# Altium project Arb_Power_Booster.PrjPcb (part 2 of 2)

## Sheet ArbPwrBoost_P8.SchDoc: =ProjectTitle
size B; Date: 05/12/25; Engineer: Hab Collector; Organization: Altium Limited; Address1: 3621 Gin Way; Address2: Snellville, GA 30039; DocumentNumber: IMR-005-SCH; Revision: 4; SheetNumber: 8; SheetTotal: 8
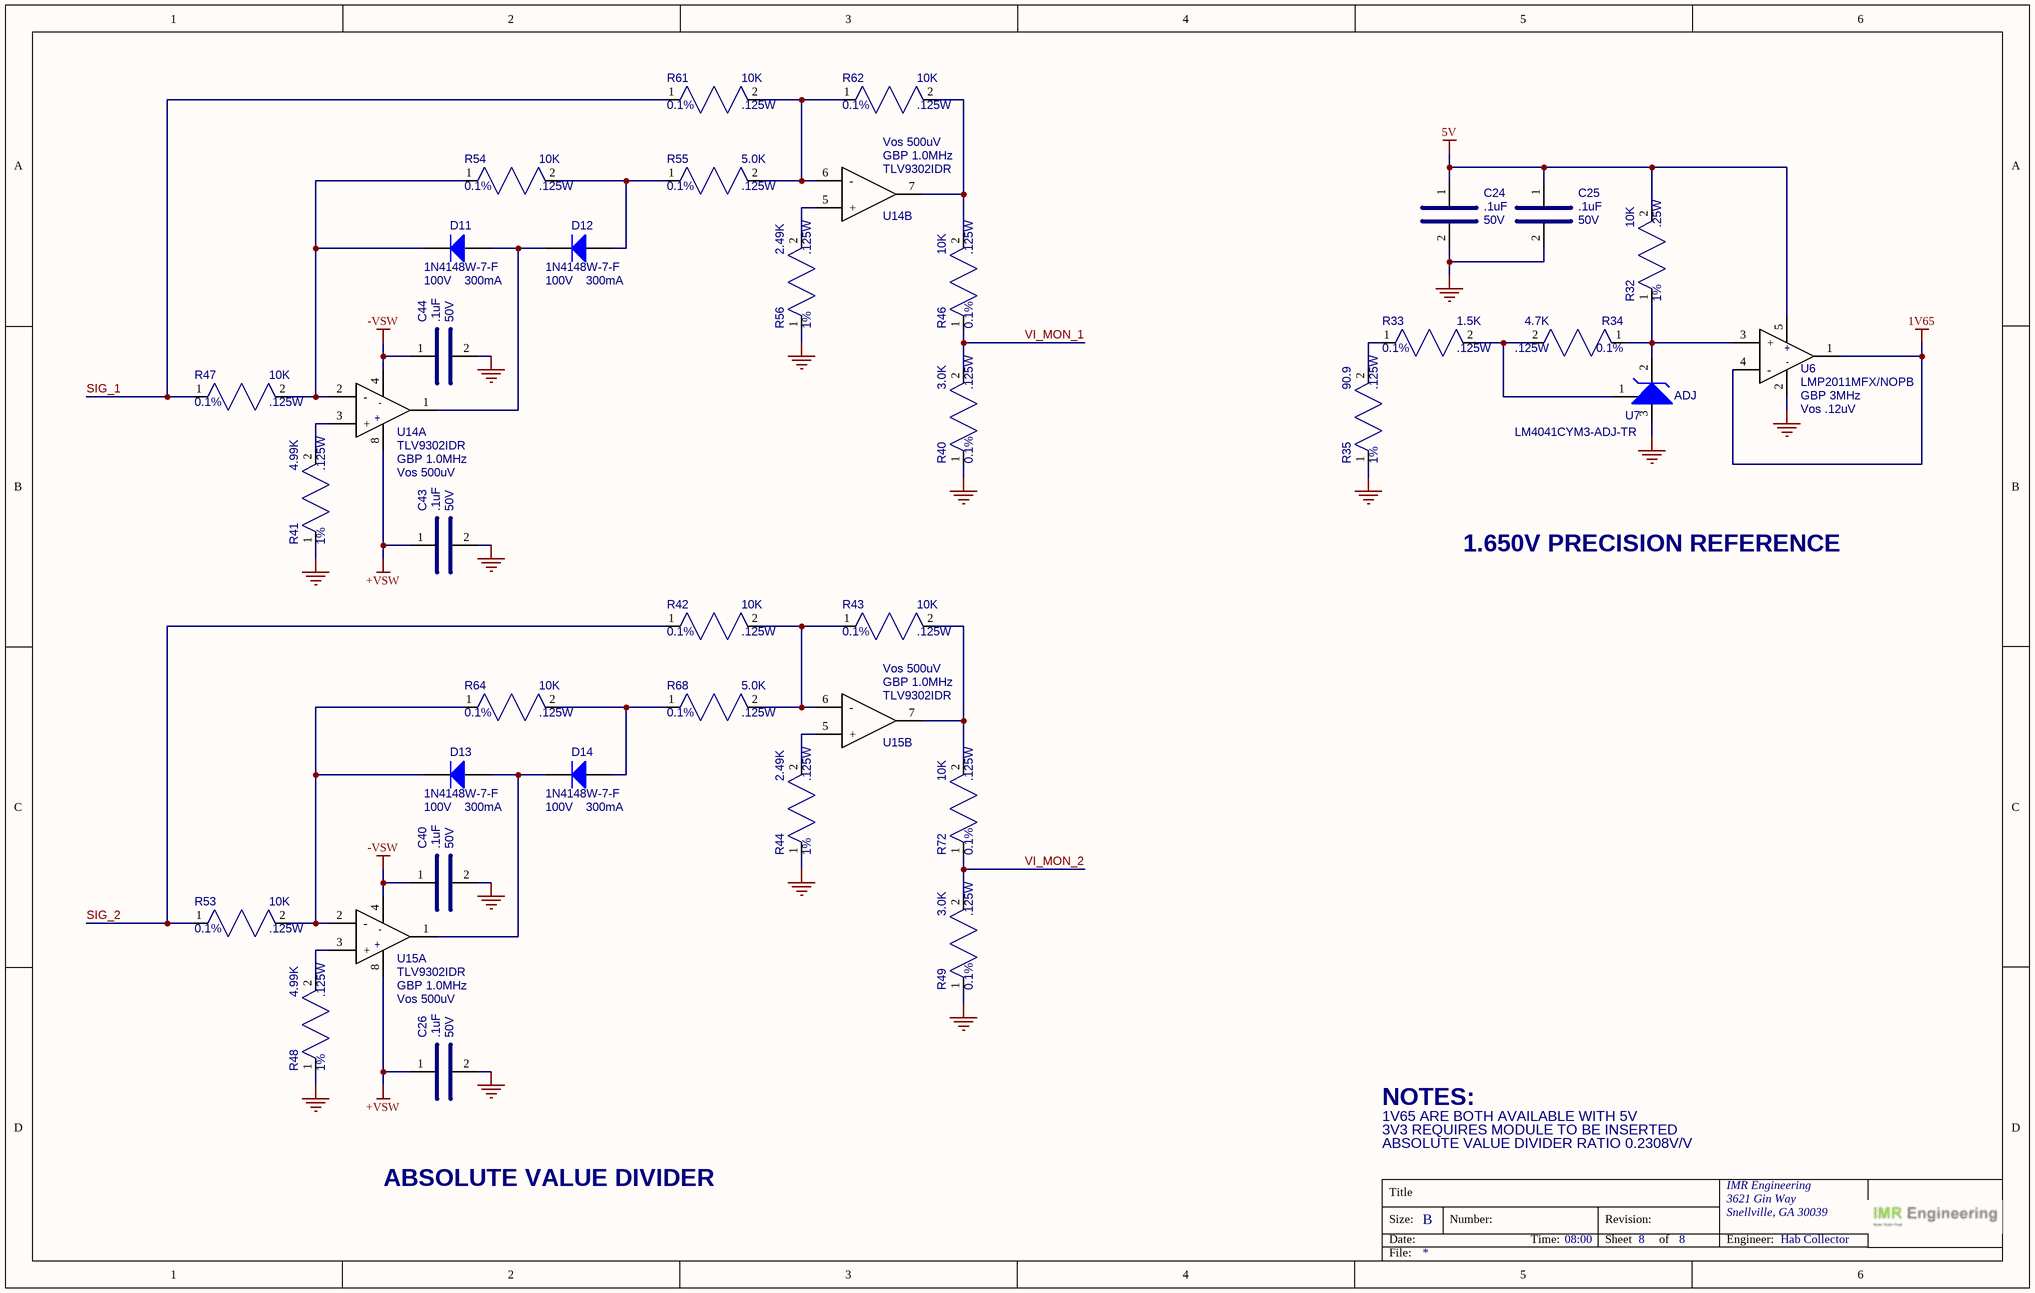
[diagram p7: ArbPwrBoost_P8.SchDoc]

### Parts
C24  value .1uF  Voltage: 50V  [CAP_0805]  (hidden comment: KGM21NR71H104KT)
C25  value .1uF  Voltage: 50V  [CAP_0805]  (hidden comment: KGM21NR71H104KT)
C26  value .1uF  Voltage: 50V  [CAP_0805]  (hidden comment: KGM21NR71H104KT)
C40  value .1uF  Voltage: 50V  [CAP_0805]  (hidden comment: KGM21NR71H104KT)
C43  value .1uF  Voltage: 50V  [CAP_0805]  (hidden comment: KGM21NR71H104KT)
C44  value .1uF  Voltage: 50V  [CAP_0805]  (hidden comment: KGM21NR71H104KT)
D11  value 100V  Current: 300mA  [SOD123]  (hidden comment: 1N4148W-7-F)
D12  value 100V  Current: 300mA  [SOD123]  (hidden comment: 1N4148W-7-F)
D13  value 100V  Current: 300mA  [SOD123]  (hidden comment: 1N4148W-7-F)
D14  value 100V  Current: 300mA  [SOD123]  (hidden comment: 1N4148W-7-F)
R32  value 10K  Power: .25W  Tolerance: 1%  [RES_0805]  (hidden comment: RC0805FR-7W10KL)
R33  value 1.5K  Power: .125W  Tolerance: 0.1%  [RES_0805]  (hidden comment: RT0805BRD071K5L)
R34  value 4.7K  Power: .125W  Tolerance: 0.1%  [RES_0805]  (hidden comment: RT0805BRD074K7L)
R35  value 90.9  Power: .125W  Tolerance: 1%  [RES_0805]  (hidden comment: RC0805FR-0790R9L)
R40  value 3.0K  Power: .125W  Tolerance: 0.1%  [RES_0805]  (hidden comment: RT0805BRD073KL)
R41  value 4.99K  Power: .125W  Tolerance: 1%  [RES_0805]  (hidden comment: RC0805FR-134K99L)
R42  value 10K  Power: .125W  Tolerance: 0.1%  [RES_0805]  (hidden comment: RP0805BRD0710KL)
R43  value 10K  Power: .125W  Tolerance: 0.1%  [RES_0805]  (hidden comment: RP0805BRD0710KL)
R44  value 2.49K  Power: .125W  Tolerance: 1%  [RES_0805]  (hidden comment: RC0805FR-132K49L)
R46  value 10K  Power: .125W  Tolerance: 0.1%  [RES_0805]  (hidden comment: RP0805BRD0710KL)
R47  value 10K  Power: .125W  Tolerance: 0.1%  [RES_0805]  (hidden comment: RP0805BRD0710KL)
R48  value 4.99K  Power: .125W  Tolerance: 1%  [RES_0805]  (hidden comment: RC0805FR-134K99L)
R49  value 3.0K  Power: .125W  Tolerance: 0.1%  [RES_0805]  (hidden comment: RT0805BRD073KL)
R53  value 10K  Power: .125W  Tolerance: 0.1%  [RES_0805]  (hidden comment: RP0805BRD0710KL)
R54  value 10K  Power: .125W  Tolerance: 0.1%  [RES_0805]  (hidden comment: RP0805BRD0710KL)
R55  value 5.0K  Power: .125W  Tolerance: 0.1%  [RES_0805]  (hidden comment: AT0805BRD075KL)
R56  value 2.49K  Power: .125W  Tolerance: 1%  [RES_0805]  (hidden comment: RC0805FR-132K49L)
R61  value 10K  Power: .125W  Tolerance: 0.1%  [RES_0805]  (hidden comment: RP0805BRD0710KL)
R62  value 10K  Power: .125W  Tolerance: 0.1%  [RES_0805]  (hidden comment: RP0805BRD0710KL)
R64  value 10K  Power: .125W  Tolerance: 0.1%  [RES_0805]  (hidden comment: RP0805BRD0710KL)
R68  value 5.0K  Power: .125W  Tolerance: 0.1%  [RES_0805]  (hidden comment: AT0805BRD075KL)
R72  value 10K  Power: .125W  Tolerance: 0.1%  [RES_0805]  (hidden comment: RP0805BRD0710KL)
U6  value GBP 3MHz  Vos: Vos .12uV  [SOT-23-5]  (hidden comment: LMP2011MFX/NOPB)
U7  value ADJ  [SOT-23]  (hidden comment: LM4041CYM3-ADJ-TR)
U14  value GBP 1.0MHz  Vos: Vos 500uV  [SOIC-8_49]  (hidden comment: TLV9302IDR)  (parts A,B of 2)
U15  value GBP 1.0MHz  Vos: Vos 500uV  [SOIC-8_49]  (hidden comment: TLV9302IDR)  (parts A,B of 2)

### Nets
1V65: U6.1 U6.4(-)
5V: C24.1 C25.1 R32.2 U6.5
+VSW: C26.1 C43.1 U14.8 U15.8
-VSW: C40.1 C44.1 U14.4 U15.4
GND: C24.2 C25.2 C26.2 C40.2 C43.2 C44.2 R35.1 R40.1 R41.1 R44.1 R48.1 R49.1 R56.1 U6.2 U7.3(A)
SIG_1: R47.1 R61.1
SIG_2: R42.1 R53.1
VI_MON_1: R40.2 R46.1
VI_MON_2: R49.2 R72.1
NetD11_1: D11.1(A) D12.2(K) U14.1
NetD11_2: D11.2(K) R47.2 R54.1 U14.2(-)
NetD12_1: D12.1(A) R54.2 R55.1
NetD13_1: D13.1(A) D14.2(K) U15.1
NetD13_2: D13.2(K) R53.2 R64.1 U15.2(-)
NetD14_1: D14.1(A) R64.2 R68.1
NetR32_1: R32.1 R34.1 U6.3(+) U7.2(K)
NetR33_1: R33.1 R35.2
NetR33_2: R33.2 R34.2 U7.1(FB)
NetR41_2: R41.2 U14.3(+)
NetR42_2: R42.2 R43.1 R68.2 U15.6(-)
NetR43_2: R43.2 R72.2 U15.7
NetR44_2: R44.2 U15.5(+)
NetR46_2: R46.2 R62.2 U14.7
NetR48_2: R48.2 U15.3(+)
NetR55_2: R55.2 R61.2 R62.1 U14.6(-)
NetR56_2: R56.2 U14.5(+)

### Notes on the sheet
- 1.650V PRECISION REFERENCE
- NOTES:
- 1V65 ARE BOTH AVAILABLE WITH 5V
- 3V3 REQUIRES MODULE TO BE INSERTED
- ABSOLUTE VALUE DIVIDER RATIO 0.2308V/V
- ABSOLUTE VALUE DIVIDER
- Title
- Size:
- Date:
- B
- Number:
- Time:
- Revision:
- Sheet
- of
- IMR Engineering
- Engineer:
- File:

### Library data of the parts
C24-C26 C40 C43 C44 = CAP_SMD_0.1UF_50V_0805: CAP CER 0.1UF 50V X7R 0805; MFG: KYOCERA AVX; Case/Package: 0805; MFG_PN: KGM21NR71H104KT; Supplier 1: DigiKey; Supplier Part Number 1: 478-KGM21NR71H104KTCT-ND; Unit Price: .1
D11-D14 = DIODE_1N4148W-7-F: RELAY REED SPDT 250MA 5V; MFG: Diodes Inc; Case/Package: SOD-123; Supplier 1: DigiKey; Supplier Part Number 1: 1N4148W-FDICT-ND; Unit Price: .16; MFG_PN: 1N4148W-7-F
R32 = RES_SMD_10K_0805_1/4W_1%: RES SMD 10K OHM 1% 1/4W 0805; MFG: Yageo; Case/Package: 0805; MFG_PN: RC0805FR-7W10KL; Supplier 1: DigiKey; Supplier Part Number 1: 13-RC0805FR-7W10KLCT-ND; Unit Price: .10
R33 = RES_SMD_1.5K_0805_1/8W_0.1%: RES SMD 1.5K OHM 0.1% 1/8W 0805; MFG: Yageo; Case/Package: 0805; MFG_PN: RT0805BRD071K5L; Supplier 1: DigiKey; Supplier Part Number 1: YAG1814CT-ND; Unit Price: .16
R34 = RES_SMD_4.7K_0805_1/8W_0.1%: RES SMD 4.7K OHM 0.1% 1/8W 0805; MFG: Yageo; Case/Package: 0805; MFG_PN: RT0805BRD074K7L; Supplier 1: DigiKey; Supplier Part Number 1: YAG1919CT-ND; Unit Price: .16
R35 = RES_SMD_90.9_0805_1/8W_1%: RES SMD 90.9 OHM 1% 1/8W 0805; MFG: Yageo; Case/Package: 0805; MFG_PN: RC0805FR-0790R9L; Supplier 1: DigiKey; Supplier Part Number 1: 311-90.9CRCT-ND; Unit Price: .1
R40 R49 = RES_SMD_3.0K_0805_1/8W_0.1%: RES SMD 3.0K OHM 0.1% 1/8W 0805; MFG: Yageo; Case/Package: 0805; MFG_PN: RT0805BRD073KL; Supplier 1: DigiKey; Supplier Part Number 1: YAG1891CT-ND; Unit Price: 0.16
R41 R48 = RES_SMD_4.99K_0805_1/8W_1%: RES SMD 4.99K OHM 1% 1/8W 0805; MFG: Yageo; Case/Package: 0805; MFG_PN: RC0805FR-134K99L; Supplier 1: DigiKey; Supplier Part Number 1: 13-RC0805FR-134K99LCT-ND; Unit Price: .1
R42 R43 R46 R47 R53 R54 R61 R62 R64 R72 = RES_SMD_10K_0805_1/8W_0.1%: RES SMD 10K OHM 0.1% 1/8W 0805; MFG: Yageo; Case/Package: 0805; MFG_PN: RP0805BRD0710KL; Supplier 1: DigiKey; Supplier Part Number 1: 13-RP0805BRD0710KLCT-ND; Unit Price: .16
R44 R56 = RES_SMD_2.49K_0805_1/8W_1%: RES SMD 2.49K OHM 1% 1/8W 0805; MFG: Yageo; Case/Package: 0805; MFG_PN: RC0805FR-132K49L; Supplier 1: DigiKey; Supplier Part Number 1: 13-RC0805FR-132K49LCT-ND; Unit Price: .1
R55 R68 = RES_SMD_5.0K_0805_1/8W_0.1%: RES SMD 5.0K OHM 0.1% 1/8W 0805; MFG: Yageo; Case/Package: 0805; MFG_PN: AT0805BRD075KL; Supplier 1: DigiKey; Supplier Part Number 1: 13-AT0805BRD075KLCT-ND; Unit Price: .56
U6 = OPAMP_LMP2011MFX/NOPB: IC OPAMP GP 3MHZ .12uV CIRCUIT SOT23-5; MFG: Texas Instruments; Package/Case: SOT-23-5; Supplier 1: DigiKey; MFG_PN: LMP2011MFX/NOPB; Unit Price: 2.33; Supplier Part Number 1: LMP2011MFX/NOPBCT-ND
U7 = IC_LM4041CYM3-ADJ-TR: IC VREF SHUNT ADJ 0.5% SOT23-3; MFG: Microchip; Case/Package: SOT-23; Supplier 1: DigiKey; Supplier Part Number 1: 576-1049-1-ND; Unit Price: .39; MFG_PN: LM4041CYM3-ADJ-TR
U14 U15 = OPAMP_TLV9302IDR: IC OPAMP GP 2 CIRCUIT 8SOIC; MFG: Texas Instruments; Unit Price: .66; Package/Case: SOT-353; Supplier 1: DigiKey; Supplier Part Number 1: 296-53513-1-ND; MFG_PN: TLV9302IDR

## Nets that join several sheets
1V65: ArbPwrBoost_P4 (R73.2), ArbPwrBoost_P7 (R74.2), ArbPwrBoost_P8 (U6.1 U6.4)
3V3: ArbPwrBoost_P2 (D2.2 D7.2), ArbPwrBoost_P3 (C23.1 R30.2 U4.1), ArbPwrBoost_P4 (C27.1 U8.6), ArbPwrBoost_P5 (JP4.2 R50.2 R51.2 R52.2), ArbPwrBoost_P6 (C39.1 R66.2 U11.1), ArbPwrBoost_P7 (C41.1 U13.6)
5V: ArbPwrBoost_P2 (D3.2 JP3.2 R10.2 REL1.1), ArbPwrBoost_P3 (D9.2 REL2.2), ArbPwrBoost_P4 (6 pins), ArbPwrBoost_P5 (C29.1 U9.CN65), ArbPwrBoost_P6 (D15.2 REL4.2), ArbPwrBoost_P7 (6 pins), ArbPwrBoost_P8 (C24.1 C25.1 R32.2 U6.5)
+VSW: ArbPwrBoost_P2 (10 pins), ArbPwrBoost_P3 (5 pins), ArbPwrBoost_P4 (5 pins), ArbPwrBoost_P6 (5 pins), ArbPwrBoost_P7 (5 pins), ArbPwrBoost_P8 (C26.1 C43.1 U14.8 U15.8)
-VSW: ArbPwrBoost_P2 (10 pins), ArbPwrBoost_P3 (C20.2 C21.2 U3.2 U4.10), ArbPwrBoost_P4 (5 pins), ArbPwrBoost_P6 (C36.2 C37.2 U10.2 U11.10), ArbPwrBoost_P7 (5 pins), ArbPwrBoost_P8 (C40.1 C44.1 U14.4 U15.4)
GND: ArbPwrBoost_P2 (31 pins), ArbPwrBoost_P3 (19 pins), ArbPwrBoost_P4 (18 pins), ArbPwrBoost_P5 (10 pins), ArbPwrBoost_P6 (19 pins), ArbPwrBoost_P7 (18 pins), ArbPwrBoost_P8 (15 pins)
+VS_MON: ArbPwrBoost_P2 (D2.1 D4.2 R3.1 R5.2), ArbPwrBoost_P5 (U9.CN53)
-VS_MON: ArbPwrBoost_P2 (D7.1 D8.2 R9.2 U2.4), ArbPwrBoost_P5 (U9.CN54)
~{R_SHDN_1}: ArbPwrBoost_P3 (U4.8), ArbPwrBoost_P5 (U9.CN72)
~{R_SHDN_2}: ArbPwrBoost_P5 (U9.CN46), ArbPwrBoost_P6 (U11.8)
ATTN_1: ArbPwrBoost_P3 (TP4.1 U4.12), ArbPwrBoost_P4 (U12.4)
ATTN_2: ArbPwrBoost_P6 (U11.12), ArbPwrBoost_P7 (U17.4)
EN_50_Z_1: ArbPwrBoost_P3 (Q8.1 R27.2), ArbPwrBoost_P5 (U9.CN74)
EN_50_Z_2: ArbPwrBoost_P5 (U9.CN48), ArbPwrBoost_P6 (Q9.1 R63.2)
EN_CH_1: ArbPwrBoost_P3 (Q11.1 R69.2), ArbPwrBoost_P5 (U9.CN73)
EN_CH_2: ArbPwrBoost_P5 (U9.CN47), ArbPwrBoost_P6 (Q12.1 R65.2)
EN_FAN_1: ArbPwrBoost_P4 (Q5.1 R25.2), ArbPwrBoost_P5 (U9.CN76)
EN_FAN_2: ArbPwrBoost_P5 (U9.CN45), ArbPwrBoost_P7 (Q6.1 R37.2)
EN_VO_1: ArbPwrBoost_P4 (Q7.1 R45.2), ArbPwrBoost_P5 (U9.CN71)
EN_VO_2: ArbPwrBoost_P5 (U9.CN44), ArbPwrBoost_P7 (Q10.1 R38.2)
IO_MON_1: ArbPwrBoost_P4 (TP6.1 U8.5), ArbPwrBoost_P5 (U9.CN51)
IO_MON_2: ArbPwrBoost_P5 (U9.CN52), ArbPwrBoost_P7 (U13.5)
MAIN_PWR_EN: ArbPwrBoost_P2 (Q3.1 R7.2), ArbPwrBoost_P5 (U9.CN43)
SCL: ArbPwrBoost_P3 (U4.2), ArbPwrBoost_P5 (R52.1 U9.CN710), ArbPwrBoost_P6 (U11.2)
SDA: ArbPwrBoost_P3 (U4.4), ArbPwrBoost_P5 (R51.1 U9.CN79), ArbPwrBoost_P6 (U11.4)
SIG_1: ArbPwrBoost_P3 (5 pins), ArbPwrBoost_P8 (R47.1 R61.1)
SIG_2: ArbPwrBoost_P6 (REL4.7 REL4.8 REL7.4 U10.1), ArbPwrBoost_P8 (R42.1 R53.1)
VI_MON_1: ArbPwrBoost_P5 (U9.CN55), ArbPwrBoost_P8 (R40.2 R46.1)
VI_MON_2: ArbPwrBoost_P5 (U9.CN56), ArbPwrBoost_P8 (R49.2 R72.1)